# Altium schematic sheet Processor.SchDoc
size A4
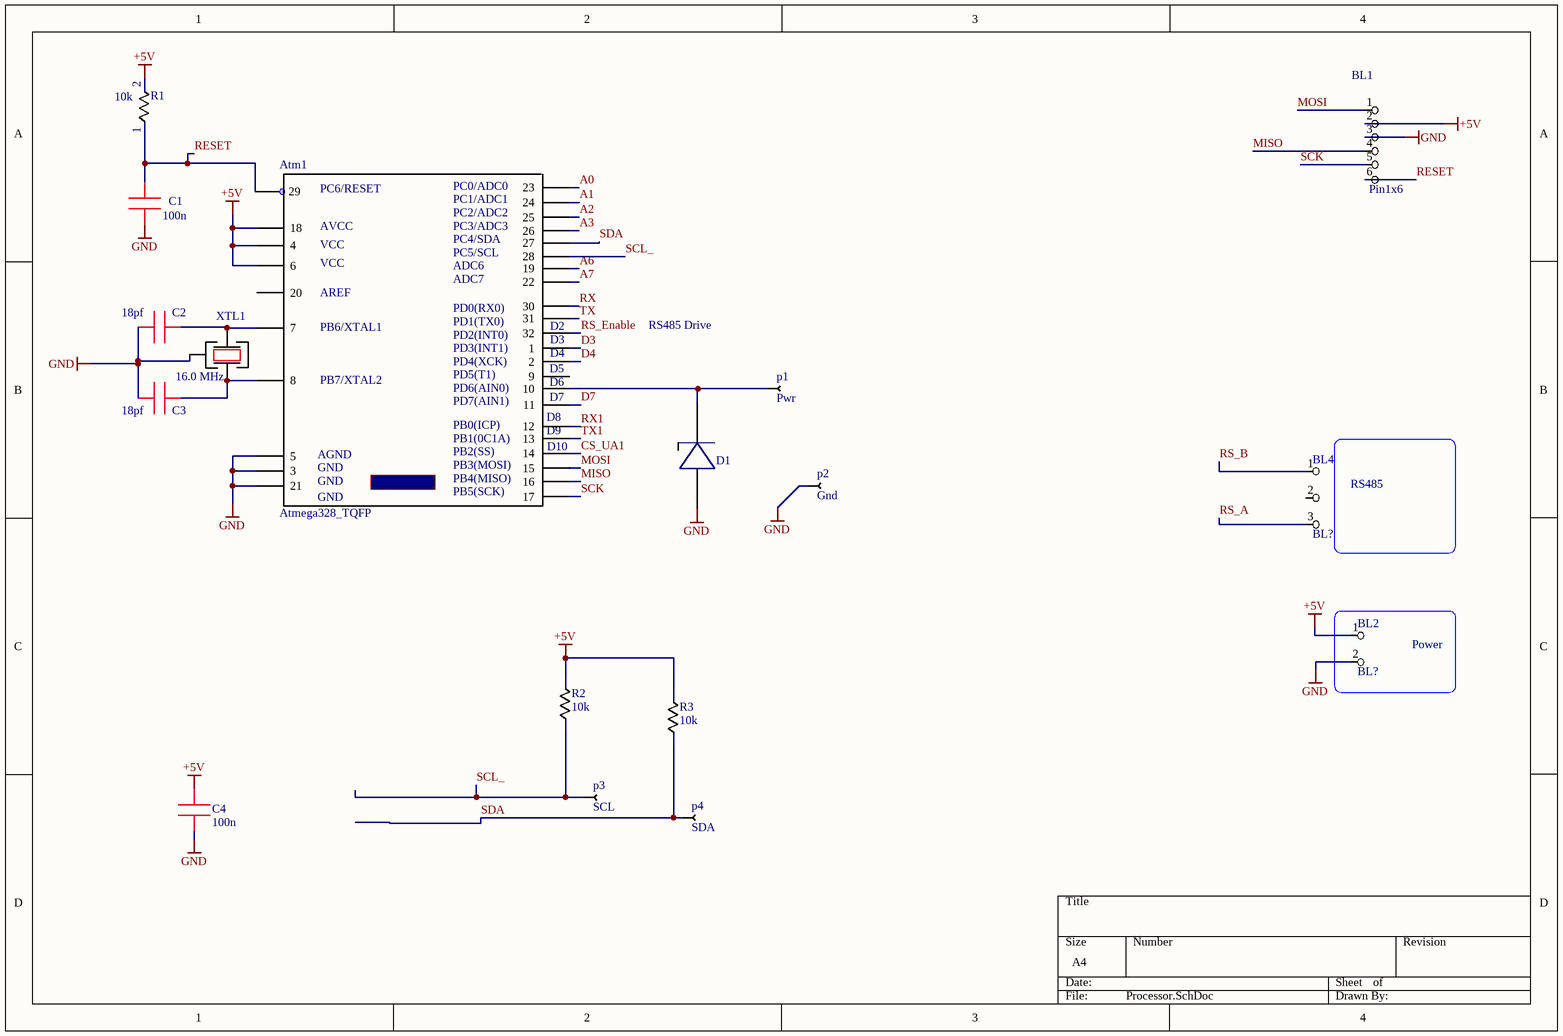
[diagram p0: Processor.SchDoc]

## Parts
Atm1  Atmega328_TQFP  [TQFP]
BL1  Pin1x6  [Pin_6 1,27]
BL2  BL?  [2.54 2pin]
BL4  BL?  [2.54 3pin]
C1  100n  [0402]
C2  18pf  [0402]
C3  18pf  [0402]
C4  100n  [0402]
D1  zener  [Sot23-3]  (value not drawn)
p1  Pwr  [Wire Pin 0.5]
p2  Gnd  [Wire Pin 0.5]
p3  SCL  [Wire Pin 0.5]
p4  SDA  [Wire Pin 0.5]
R1  10k  [0402]
R2  10k  [0402]
R3  10k  [0402]
XTL1  16.0 MHz  [KX-7 XTAL]

## Blocks framed on the sheet
Power: BL2

## Nets
+5V: Atm1.4 Atm1.6 Atm1.18 BL1.2 BL2.1 C4.2 R1.2 R2.2 R3.2
GND: Atm1.3 Atm1.5 Atm1.21 BL1.3 BL2.2 C1.1 C2.1 C3.1 C4.1 D1.1 p2.1 XTL1.2
A0: Atm1.23
A1: Atm1.24
A2: Atm1.25
A3: Atm1.26
A6: Atm1.19
A7: Atm1.22
CS_UA1: Atm1.14
D3: Atm1.1
D4: Atm1.2
D7: Atm1.11
MISO: Atm1.16 BL1.4
MOSI: Atm1.15 BL1.1
RESET: Atm1.29 BL1.6 C1.2 R1.1
RS_A: BL4.3
RS_B: BL4.1
RS_Enable: Atm1.32
RX: Atm1.30
RX1: Atm1.12
SCK: Atm1.17 BL1.5
SCL_: Atm1.28 p3.1 R2.1
SDA: Atm1.27 p4.1 R3.1
TX: Atm1.31
TX1: Atm1.13
NetAtm1_7: Atm1.7 C2.2 XTL1.1
NetAtm1_8: Atm1.8 C3.2 XTL1.3
NetAtm1_10: Atm1.10 D1.3 p1.1

Not connected (* = marked no-connect by the designer): Atm1 9 20; BL4 2

## Notes on the sheet
- (near Atm1) D5
- (near Atm1) D6
- (near Atm1) D3
- (near Atm1) D2
- (near Atm1) D4
- RS485 Drive
- (near Atm1) D8
- (near Atm1) D9
- (near Atm1) D10
- (near Atm1) D7
- (near BL4) RS485
- (in symbol Atmega328_TQFP) PC6/RESET; PC0/ADC0; PC1/ADC1; PC2/ADC2; AVCC; PC3/ADC3; PC4/SDA; VCC; PC5/SCL; ADC6; ADC7; AREF; PD0(RX0); PD1(TX0); PB6/XTAL1; PD2(INT0); PD3(INT1); PD4(XCK); PD5(T1); PB7/XTAL2; PD6(AIN0); PD7(AIN1); PB0(ICP); PB1(0C1A); PB2(SS); AGND; PB3(MOSI); GND; PB4(MISO); PB5(SCK)

## Library data of the parts
BL1 = Pin1x6: PLL-6
BL2 = 2.54 2pin
BL4 = 2.54 3pin
C1 = Capasitor 0805: C1005X7R1H104K050BB
C2 C3 = Capasitor 0805: CC0402JRNPO9BN180
C4 = 0805 Cap: C1005X7R1H104K050BB
D1 = BZX84: BZX84C5V6LT1G
p1-p4 = PIN_Wire: pin
R1-R3 = Resistor 0805: RC0402FR-0710KL
XTL1 = KX-7: KX-7T 16.0 MHz 50/100/100